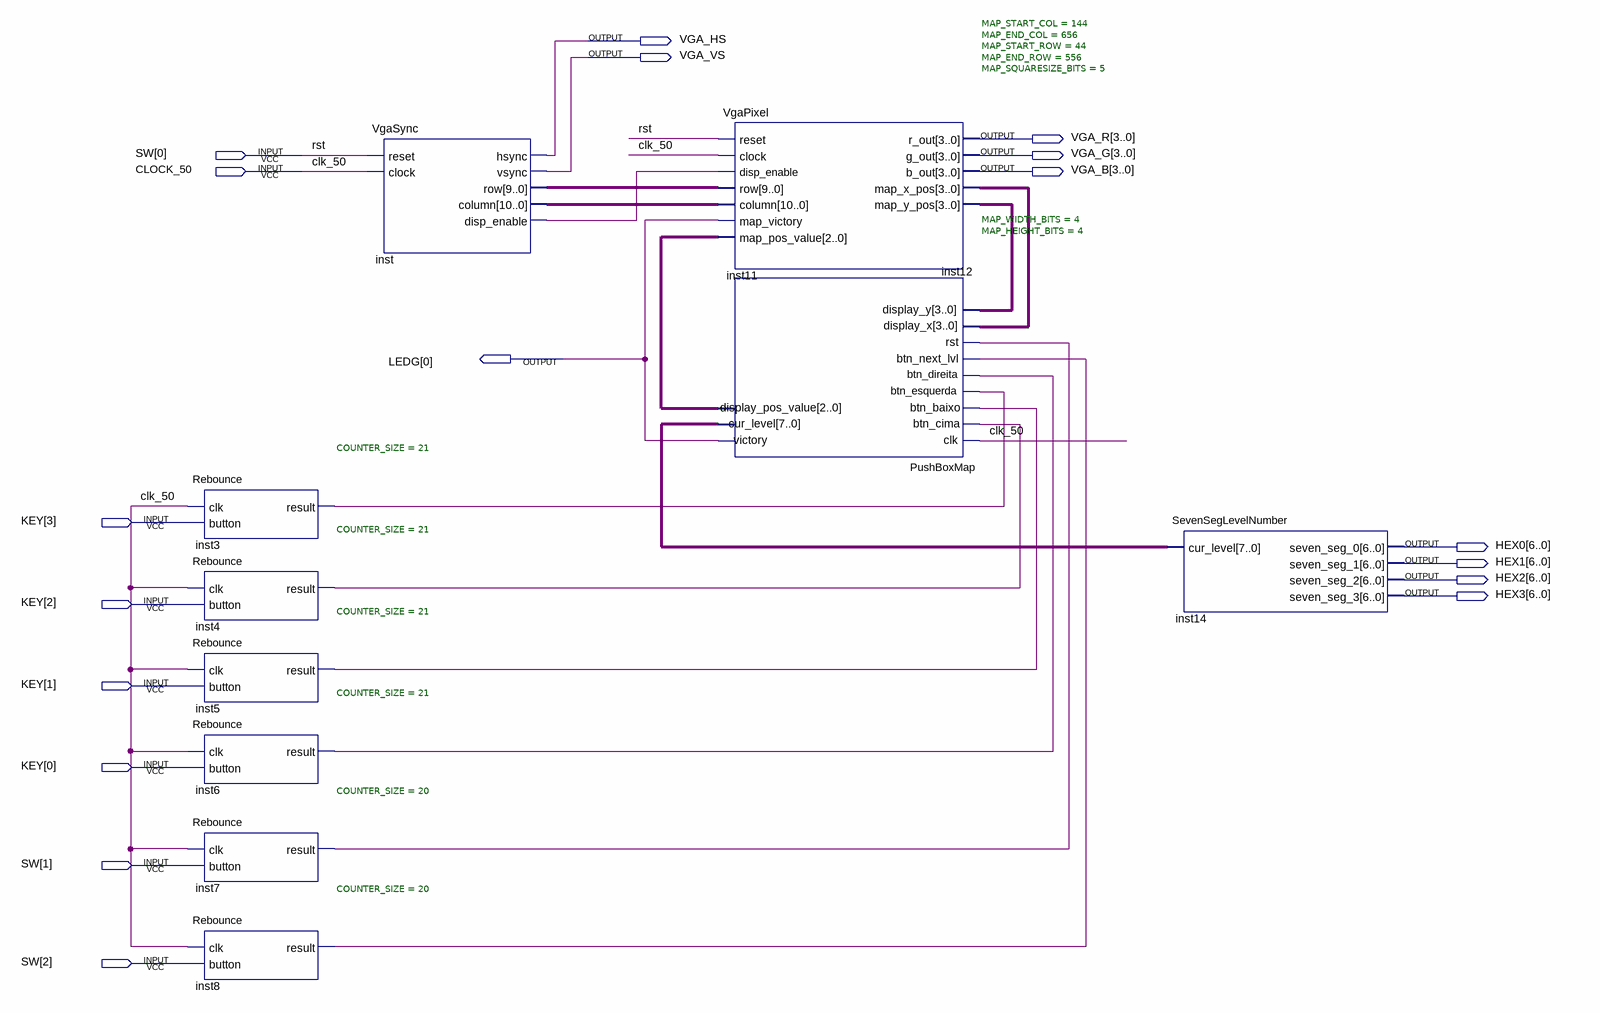
[diagram p0: schematic sheet]
// Quartus schematic PushBox.bdf as structural Verilog: 10 symbols, 18 pins
module PushBox (
  input  [2:0] SW,
  input  CLOCK_50,
  input  [3:0] KEY,
  output VGA_HS,
  output VGA_VS,
  output [3:0] VGA_R,
  output [3:0] VGA_G,
  output [3:0] VGA_B,
  output [0:0] LEDG,
  output [6:0] HEX0,
  output [6:0] HEX1,
  output [6:0] HEX2,
  output [6:0] HEX3
);

  wire inst3_result, inst4_result, inst5_result, inst6_result, inst7_result, inst8_result, inst_disp_enable;
  wire [2:0] inst12_display_pos_value;
  wire [3:0] inst11_map_x_pos, inst11_map_y_pos;
  wire [7:0] inst12_cur_level;
  wire [9:0] inst_row;
  wire [10:0] inst_column;

  Rebounce #(.COUNTER_SIZE(21)) inst3 (.clk(CLOCK_50), .button(KEY[3]), .result(inst3_result));
  Rebounce #(.COUNTER_SIZE(21)) inst4 (.clk(CLOCK_50), .button(KEY[2]), .result(inst4_result));
  Rebounce #(.COUNTER_SIZE(21)) inst5 (.clk(CLOCK_50), .button(KEY[1]), .result(inst5_result));
  Rebounce #(.COUNTER_SIZE(21)) inst6 (.clk(CLOCK_50), .button(KEY[0]), .result(inst6_result));
  Rebounce #(.COUNTER_SIZE(20)) inst7 (.clk(CLOCK_50), .button(SW[1]), .result(inst7_result));
  Rebounce #(.COUNTER_SIZE(20)) inst8 (.clk(CLOCK_50), .button(SW[2]), .result(inst8_result));
  VgaSync inst (
    .reset(SW[0]), .clock(CLOCK_50), .hsync(VGA_HS), .vsync(VGA_VS), .row(inst_row), .column(inst_column),
    .disp_enable(inst_disp_enable));
  VgaPixel #(.MAP_START_COL(144), .MAP_END_COL(656), .MAP_START_ROW(44), .MAP_END_ROW(556), .MAP_SQUARESIZE_BITS(5)) inst11 (
    .reset(SW[0]), .clock(CLOCK_50), .disp_enable(inst_disp_enable), .row(inst_row), .column(inst_column),
    .map_victory(LEDG[0]), .map_pos_value(inst12_display_pos_value), .r_out(VGA_R), .g_out(VGA_G),
    .b_out(VGA_B), .map_x_pos(inst11_map_x_pos), .map_y_pos(inst11_map_y_pos));
  PushBoxMap #(.MAP_WIDTH_BITS(4), .MAP_HEIGHT_BITS(4)) inst12 (
    .clk(CLOCK_50), .btn_cima(inst4_result), .btn_baixo(inst5_result), .btn_esquerda(inst3_result),
    .btn_direita(inst6_result), .btn_next_lvl(inst8_result), .rst(inst7_result),
    .display_x(inst11_map_x_pos), .display_y(inst11_map_y_pos), .victory(LEDG[0]),
    .cur_level(inst12_cur_level), .display_pos_value(inst12_display_pos_value));
  SevenSegLevelNumber inst14 (
    .cur_level(inst12_cur_level), .seven_seg_0(HEX0), .seven_seg_1(HEX1), .seven_seg_2(HEX2),
    .seven_seg_3(HEX3));

  // Other names for the same wires on the sheet: clk_50 = CLOCK_50; rst = SW[0]
endmodule
